# Altium project X-Bot.PrjPCB
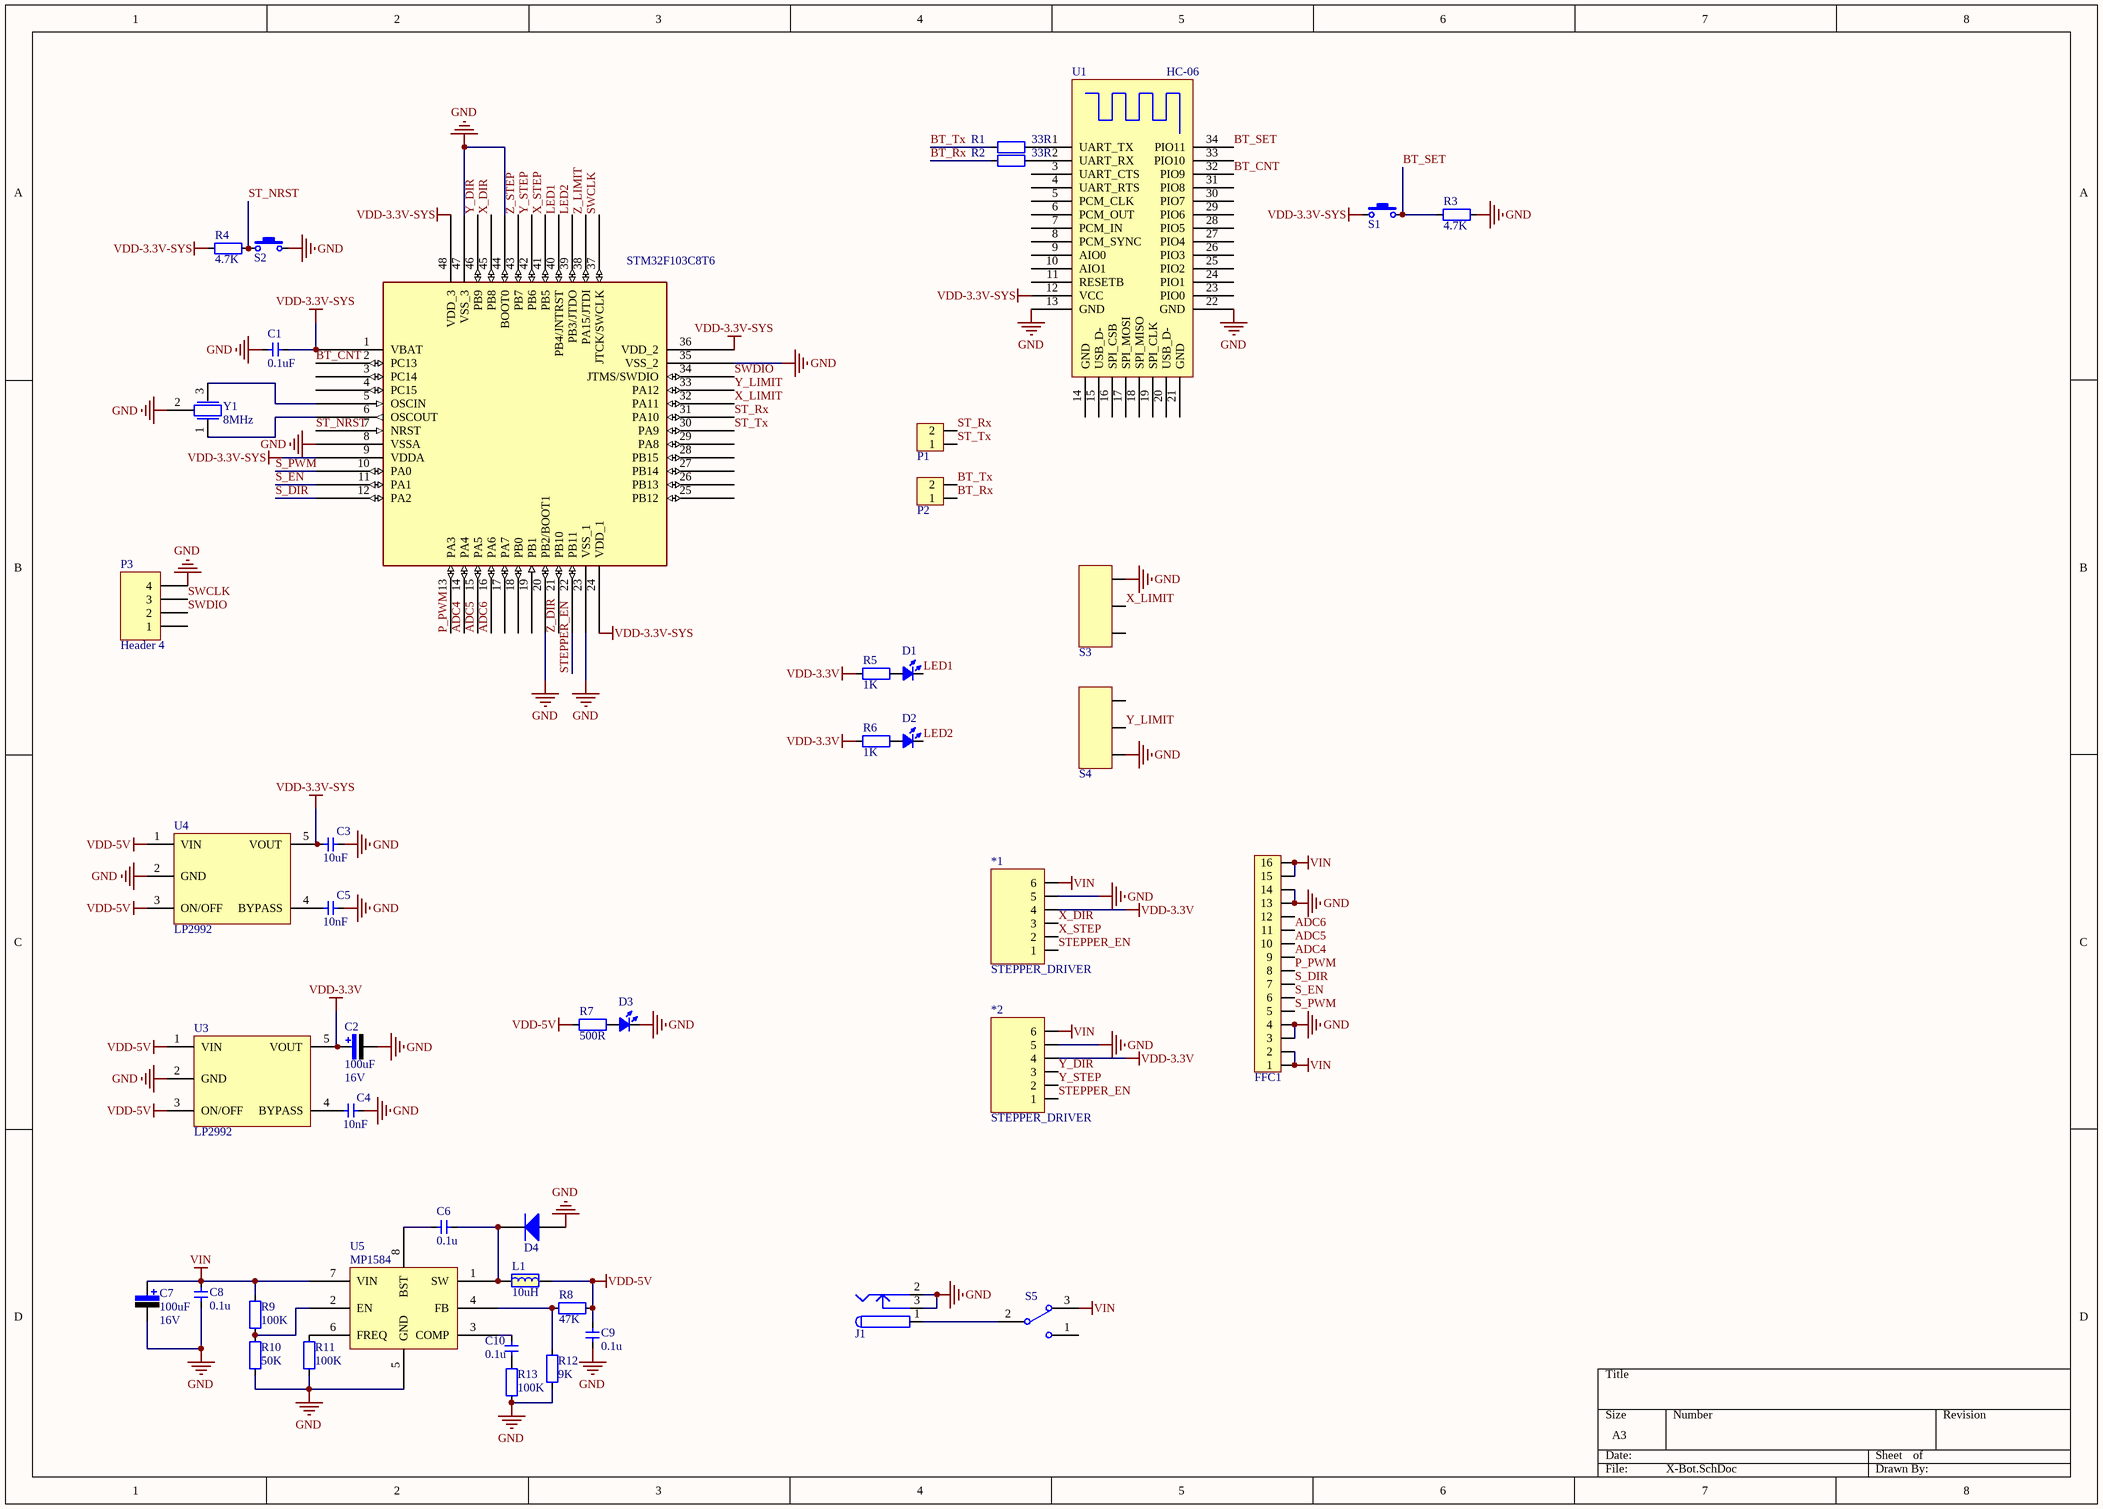
[diagram p0: X-Bot.SchDoc]
1 sheet, 46 parts. Net scope: global (net labels, ports and power ports of the same name join across sheets).
Board file: X-Bot.PcbDoc

## Sheet X-Bot.SchDoc
size A3

### Parts
*1  STEPPER_DRIVER  [STEPPER_DRIVER]
*2  STEPPER_DRIVER  [STEPPER_DRIVER]
C1  0.1uF  [0603-CAP]
C2  value 100uF  Vol: 16V  [3528-CAP]  (hidden comment: 电容 3528)
C3  value 10uF  [0603-CAP]  (hidden comment: 10nF)
C4  10nF  [0603-CAP]
C5  10nF  [0603-CAP]
C6  value 0.1u  [0603-CAP]  (hidden comment: 电容-0603)
C7  value 100uF  Vol: 16V  [3528-CAP]  (hidden comment: 电容 3528)
C8  value 0.1u  [0603-CAP]  (hidden comment: 电容-0603)
C9  value 0.1u  [0603-CAP]  (hidden comment: 电容-0603)
C10  value 0.1u  [0603-CAP]  (hidden comment: 电容-0603)
D1  LED-0603  [0603-LED-BLUE]  (value not drawn)
D2  LED-0603  [0603-LED-BLUE]  (value not drawn)
D3  LED-0603  [0603-LED-BLUE]  (value not drawn)
D4  二极管-5819W  [SOD-123]  (value not drawn)
FFC1  FFC_0.5_16  [FFC_0.5_16]  (value not drawn)
J1  PowerJack_2.5  [KLD_0202]  (value not drawn)
L1  10uH  [L-SMD-7]
P1  HDR1x2_2.54  [HDR1X2_2.54_180]  (value not drawn)
P2  HDR1x2_2.54  [HDR1X2_2.54_180]  (value not drawn)
P3  Header 4  [HDR1X4]
R1  value 33R  [0603-RES]  (hidden comment: 500R)
R2  value 33R  [0603-RES]  (hidden comment: 500R)
R3  4.7K  [0603-RES]
R4  4.7K  [0603-RES]
R5  value 1K  [0603-RES]  (hidden comment: 500R)
R6  value 1K  [0603-RES]  (hidden comment: 500R)
R7  500R  [0603-RES]
R8  value 47K  [0603-RES]  (hidden comment: 100K)
R9  100K  [0603-RES]
R10  value 50K  [0603-RES]  (hidden comment: 100K)
R11  100K  [0603-RES]
R12  value 9K  [0603-RES]  (hidden comment: 100K)
R13  100K  [0603-RES]
S1  ButtonTACT_3x4x2_180  [ButtonTACT_3x4x2_180H]  (value not drawn)
S2  ButtonTACT_3x4x2_180  [ButtonTACT_3x4x2_180H]  (value not drawn)
S3  LimitSwitch  [Limit Switch]  (value not drawn)
S4  LimitSwitch  [Limit Switch]  (value not drawn)
S5  SwitchSPDT_4.3x8.6_D90  [SwitchSPDT_4.3X8.6_D90]  (value not drawn)
U1  HC-06  [蓝牙模块HC-06]
U2  STM32F103C8T6  [LQFP-48]
U3  LP2992  [SOT23-5]
U4  LP2992  [SOT23-5]
U5  MP1584  [SO-8]
Y1  8MHz  [晶振-3P]

### Nets
GND: *1.5 *2.5 C1.1 C2.2 C3.1 C4.1 C5.1 C7.2 C8.1 C9.2 D3.2(K) D4.1(A) FFC1.3 FFC1.4 FFC1.13 FFC1.14 J1.2 J1.3 P3.4 R3.1 R10.1 R11.1 R12.1 R13.1 S2.2 S3.3 S4.1 U1.13(GND) U1.22(GND) U2.8(VSSA) U2.20(PB2/BOOT1) U2.23(VSS_1) U2.35(VSS_2) U2.44(BOOT0) U2.47(VSS_3) U3.2(GND) U4.2(GND) U5.5(GND) Y1.2
VDD-3.3V: *1.4 *2.4 C2.1 R5.1 R6.1 U3.5(VOUT)
VDD-3.3V-SYS: C1.2 C3.2 R4.2 S1.1 U1.12(VCC) U2.1(VBAT) U2.9(VDDA) U2.24(VDD_1) U2.36(VDD_2) U2.48(VDD_3) U4.5(VOUT)
VDD-5V: C9.1 L1.2 R7.1 R8.1 U3.1(VIN) U3.3(ON/OFF) U4.1(VIN) U4.3(ON/OFF)
VIN: *1.6 *2.6 C7.1 C8.2 FFC1.1 FFC1.2 FFC1.15 FFC1.16 R9.2 S5.3 U5.7(VIN)
ADC4: FFC1.9 U2.14(PA4)
ADC5: FFC1.10 U2.15(PA5)
ADC6: FFC1.11 U2.16(PA6)
BT_CNT: U1.32(PIO9) U2.2(PC13)
BT_Rx: P2.1 R2.1
BT_SET: R3.2 S1.2 U1.34(PIO11)
BT_Tx: P2.2 R1.1
LED1: D1.2(K) U2.40(PB4/JNTRST)
LED2: D2.2(K) U2.39(PB3/JTDO)
P_PWM: FFC1.8 U2.13(PA3)
S_DIR: FFC1.7 U2.12(PA2)
S_EN: FFC1.6 U2.11(PA1)
S_PWM: FFC1.5 U2.10(PA0)
ST_NRST: R4.1 S2.1 U2.7(NRST)
ST_Rx: P1.2 U2.31(PA10)
ST_Tx: P1.1 U2.30(PA9)
STEPPER_EN: *1.1 *2.1 U2.22(PB11)
SWCLK: P3.3 U2.37(JTCK/SWCLK)
SWDIO: P3.2 U2.34(JTMS/SWDIO)
X_DIR: *1.3 U2.45(PB8)
X_LIMIT: S3.2 U2.32(PA11)
X_STEP: *1.2 U2.41(PB5)
Y_DIR: *2.3 U2.46(PB9)
Y_LIMIT: S4.2 U2.33(PA12)
Y_STEP: *2.2 U2.42(PB6)
Z_DIR: U2.21(PB10)
Z_LIMIT: U2.38(PA15/JTDI)
Z_STEP: U2.43(PB7)
NetC4_2: C4.2 U3.4(BYPASS)
NetC5_2: C5.2 U4.4(BYPASS)
NetC6_1: C6.1 U5.8(BST)
NetC6_2: C6.2 D4.2(K) L1.1 U5.1(SW)
NetC10_1: C10.1 R13.2
NetC10_2: C10.2 U5.3(COMP)
NetD1_1: D1.1(A) R5.2
NetD2_1: D2.1(A) R6.2
NetD3_1: D3.1(A) R7.2
NetJ1_1: J1.1 S5.2
NetR1_2: R1.2 U1.1(UART_TX)
NetR2_2: R2.2 U1.2(UART_RX)
NetR8_2: R8.2 R12.2 U5.4(FB)
NetR9_1: R9.1 R10.2 U5.2(EN)
NetR11_2: R11.2 U5.6(FREQ)
NetU2_5: U2.5(OSCIN) Y1.3
NetU2_6: U2.6(OSCOUT) Y1.1

Not connected (* = marked no-connect by the designer): FFC1 12; P3 1; S3 1; S4 3; S5 1; U1 3(UART_CTS) 4(UART_RTS) 5(PCM_CLK) 6(PCM_OUT) 7(PCM_IN) 8(PCM_SYNC) 9(AIO0) 10(AIO1) 11(RESETB) 14(GND) 15(USB_D-) 16(SPI_CSB) 17(SPI_MOSI) 18(SPI_MISO) 19(SPI_CLK) 20(USB_D-) 21(GND) 23(PIO0) 24(PIO1) 25(PIO2) 26(PIO3) 27(PIO4) 28(PIO5) 29(PIO6) 30(PIO7) 31(PIO8) 33(PIO10); U2 3(PC14) 4(PC15) 17(PA7) 18(PB0) 19(PB1) 25(PB12) 26(PB13) 27(PB14) 28(PB15) 29(PA8)

### Library data of the parts
C1 = 电容-0603: Capacitor; Value: 0.1u
C2 C7 = 电容 3528: 极性电解电容; Published: 8-Jun-2000; LatestRevisionDate: 17-Jul-2002; LatestRevisionNote: Re-released for DXP Platform.; PackageReference: RB7.6-15; Publisher: Altium Limited
C3-C6 C8-C10 = 电容-0603: Capacitor
  C4 C5: Value: 10nF
D1-D3 = LED-0603: LED
D4 = 二极管-5819W: 40V
FFC1 = FFC_0.5_16: FFC
J1 = PowerJack_2.5: DC Power Jack
L1 = 电感-0805: 磁珠
P1 P2 = HDR1x2_2.54: Header
P3 = Header 4: Header, 4-Pin; LatestRevisionDate: 17-Jul-2002; LatestRevisionNote: Re-released for DXP Platform.; Publisher: Altium Limited
R1-R13 = 电阻-0603: Resistor
  R3 R4: Value: 4.7K
  R7: Value: 500R
  R9 R11 R13: Value: 100K
S1 S2 = ButtonTACT_3x4x2_180: Button
S5 = SwitchSPDT_4.3x8.6_D90: Switch
U1 = HM01_02_09_1: HM bluetooth module HM-01,HM-02,HM-09
U2 = STM32F103C8T6: MCU; Manuf_1: STM; Ref St: 9175981; Provided: ST; Footprint: QFP48 7X7; Manuf_Part_1: STM32F103C8T6; Order: STM32F103C8T6; Distrib: ST
U3 U4 = LP2992: LDO
U5 = MP1584: 电源芯片
Y1 = 晶振-3Pin: 村田贴片